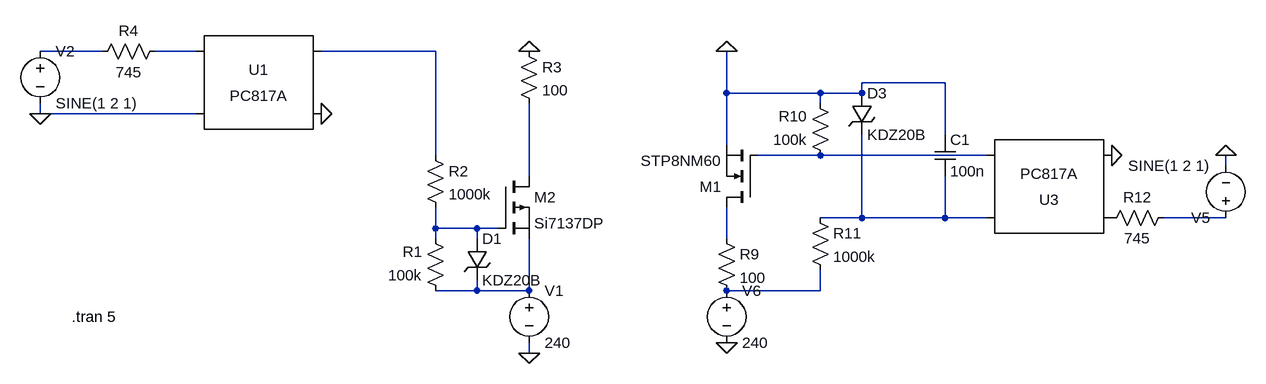
[diagram p0: schematic Draft1.asc]
Draft1.asc, the LTspice schematic file:
Version 4
SHEET 1 2532 680
WIRE -496 -272 -592 -272
WIRE -352 -272 -416 -272
WIRE 16 -272 -160 -272
WIRE 800 -224 672 -224
WIRE 464 -208 464 -272
WIRE 608 -208 464 -208
WIRE 672 -208 672 -224
WIRE 672 -208 608 -208
WIRE 608 -192 608 -208
WIRE -592 -176 -592 -192
WIRE -352 -176 -592 -176
WIRE 800 -144 800 -224
WIRE 464 -128 464 -208
WIRE 16 -112 16 -272
WIRE 608 -112 512 -112
WIRE 864 -112 608 -112
WIRE 1232 -96 1232 -112
WIRE 160 -80 160 -192
WIRE 672 -16 672 -144
WIRE 672 -16 608 -16
WIRE 800 -16 800 -80
WIRE 800 -16 672 -16
WIRE 864 -16 800 -16
WIRE 1232 -16 1136 -16
WIRE 16 0 16 -32
WIRE 80 0 16 0
WIRE 112 0 80 0
WIRE 16 16 16 0
WIRE 80 16 80 0
WIRE 464 16 464 -32
WIRE 80 96 80 80
WIRE 80 96 16 96
WIRE 160 96 160 16
WIRE 160 96 80 96
WIRE 608 96 608 64
WIRE 608 96 464 96
WIRE 160 192 160 176
FLAG 160 -272 0
FLAG 160 192 0
FLAG -592 -176 0
FLAG -160 -176 0
FLAG 464 -272 0
FLAG 1232 -112 0
FLAG 1056 -112 0
FLAG 464 176 0
SYMBOL pmos 112 -80 R0
SYMATTR InstName M2
SYMATTR Value Si7137DP
SYMBOL voltage 160 80 R0
WINDOW 123 0 0 Left 0
WINDOW 39 0 0 Left 0
SYMATTR InstName V1
SYMATTR Value 240
SYMBOL res 32 112 R180
WINDOW 0 36 76 Left 2
WINDOW 3 36 40 Left 2
SYMATTR InstName R1
SYMATTR Value 100k
SYMBOL res 0 -128 R0
SYMATTR InstName R2
SYMATTR Value 1000k
SYMBOL res 144 -288 R0
SYMATTR InstName R3
SYMATTR Value 100
SYMBOL voltage -592 -288 R0
WINDOW 123 0 0 Left 0
WINDOW 39 0 0 Left 0
SYMATTR InstName V2
SYMATTR Value SINE(1 2 1)
SYMBOL res -512 -256 R270
WINDOW 0 32 56 VTop 2
WINDOW 3 0 56 VBottom 2
SYMATTR InstName R4
SYMATTR Value 745
SYMBOL Optos\\PC817A -256 -224 R0
SYMATTR InstName U1
SYMBOL zener 64 16 R0
SYMATTR InstName D1
SYMATTR Value KDZ20B
SYMATTR Description Diode
SYMATTR Type diode
SYMBOL nmos 512 -32 R180
SYMATTR InstName M1
SYMATTR Value STP8NM60
SYMBOL res 448 0 R0
SYMATTR InstName R9
SYMATTR Value 100
SYMBOL res 624 -96 R180
WINDOW 0 36 76 Left 2
WINDOW 3 36 40 Left 2
SYMATTR InstName R10
SYMATTR Value 100k
SYMBOL res 592 -32 R0
SYMATTR InstName R11
SYMATTR Value 1000k
SYMBOL Optos\\PC817A 960 -64 R180
SYMATTR InstName U3
SYMBOL zener 656 -208 R0
SYMATTR InstName D3
SYMATTR Value KDZ20B
SYMATTR Description Diode
SYMATTR Type diode
SYMBOL voltage 1232 0 R180
WINDOW 123 0 0 Left 0
WINDOW 39 0 0 Left 0
SYMATTR InstName V5
SYMATTR Value SINE(1 2 1)
SYMBOL res 1152 -32 R90
WINDOW 0 0 56 VBottom 2
WINDOW 3 32 56 VTop 2
SYMATTR InstName R12
SYMATTR Value 745
SYMBOL voltage 464 80 R0
WINDOW 123 0 0 Left 0
WINDOW 39 0 0 Left 0
SYMATTR InstName V6
SYMATTR Value 240
SYMBOL cap 784 -144 R0
SYMATTR InstName C1
SYMATTR Value 100n
TEXT -544 136 Left 2 !.tran 5

The netlist it stands for:
* Draft1.asc
M2 N005 N008 N010 N010 Si7137DP
V1 N010 0 240
R1 N010 N008 100k
R2 N003 N008 1000k
R3 0 N005 100
V2 N001 0 SINE(1 2 1)
R4 N001 N002 745
XU1 N002 0 N003 0 PC817 Igain=1m
D1 N008 N010 KDZ20B
M1 N009 N004 0 0 STP8NM60
R9 N009 N011 100
R10 N004 0 100k
R11 N006 N011 1000k
XU3 P001 0 N006 N004 PC817 Igain=1m
D3 0 N006 KDZ20B
V5 N007 0 SINE(1 2 1)
R12 N007 P001 745
V6 N011 0 240
C1 0 N006 100n
.model D D
.lib standard.dio
.model NMOS NMOS
.model PMOS PMOS
.lib standard.mos
.tran 5
.lib PC817.sub
.backanno
.end